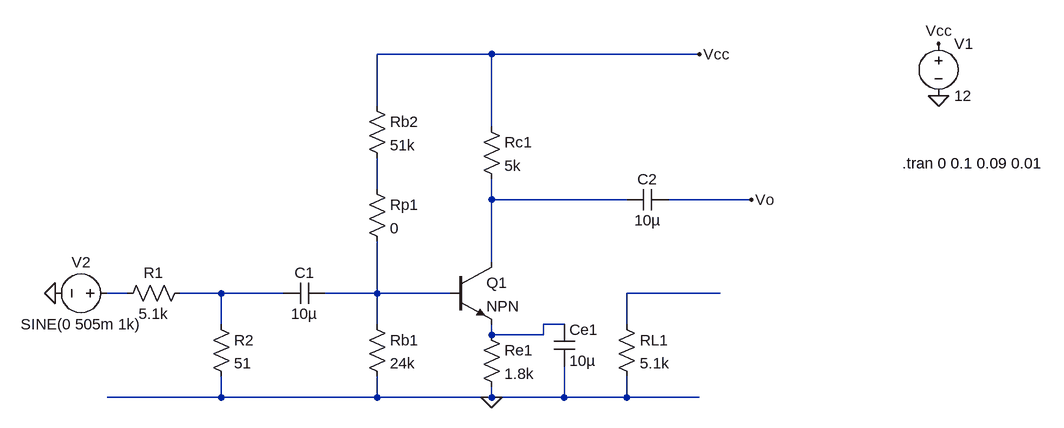
[diagram p0: schematic Experiment2_2_3.asc]
Experiment2_2_3.asc, the LTspice schematic file:
Version 4.1
SHEET 1 1096 680
WIRE 224 -32 48 -32
WIRE 544 -32 224 -32
WIRE 48 48 48 -32
WIRE 224 80 224 -32
WIRE 48 176 48 128
WIRE 224 192 224 160
WIRE 432 192 224 192
WIRE 624 192 496 192
WIRE 224 288 224 192
WIRE -336 336 -368 336
WIRE -192 336 -256 336
WIRE -96 336 -192 336
WIRE 48 336 48 256
WIRE 48 336 -32 336
WIRE 160 336 48 336
WIRE 576 336 432 336
WIRE -192 384 -192 336
WIRE 48 384 48 336
WIRE 336 384 304 384
WIRE 432 384 432 336
WIRE 224 400 224 384
WIRE 304 400 304 384
WIRE 304 400 224 400
WIRE -192 496 -192 464
WIRE -192 496 -368 496
WIRE 48 496 48 464
WIRE 48 496 -192 496
WIRE 224 496 224 480
WIRE 224 496 48 496
WIRE 336 496 336 448
WIRE 336 496 224 496
WIRE 432 496 432 464
WIRE 432 496 336 496
WIRE 544 496 432 496
FLAG 224 496 0
FLAG 544 -32 Vcc
FLAG 912 -48 Vcc
FLAG 912 32 0
FLAG 624 192 Vo
FLAG -448 336 0
SYMBOL res -240 320 R90
WINDOW 0 0 56 VBottom 2
WINDOW 3 32 56 VTop 2
SYMATTR InstName R1
SYMATTR Value 5.1k
SYMBOL res -208 368 R0
SYMATTR InstName R2
SYMATTR Value 51
SYMBOL res 32 368 R0
SYMATTR InstName Rb1
SYMATTR Value 24k
SYMBOL res 32 160 R0
SYMATTR InstName Rp1
SYMATTR Value 0
SYMBOL res 32 32 R0
SYMATTR InstName Rb2
SYMATTR Value 51k
SYMBOL npn 160 288 R0
SYMATTR InstName Q1
SYMBOL res 208 384 R0
SYMATTR InstName Re1
SYMATTR Value 1.8k
SYMBOL res 416 368 R0
SYMATTR InstName RL1
SYMATTR Value 5.1k
SYMBOL res 208 64 R0
SYMATTR InstName Rc1
SYMATTR Value 5k
SYMBOL voltage 912 -64 R0
WINDOW 123 0 0 Left 0
WINDOW 39 0 0 Left 0
SYMATTR InstName V1
SYMATTR Value 12
SYMBOL cap -32 320 R90
WINDOW 0 0 32 VBottom 2
WINDOW 3 32 32 VTop 2
SYMATTR InstName C1
SYMATTR Value 10µ
SYMATTR SpiceLine V=6.3 Irms=0 Rser=4 Lser=0 mfg="AVX" pn="TAJA106M006" type="Tantalum"
SYMBOL cap 432 208 R270
WINDOW 0 32 32 VTop 2
WINDOW 3 0 32 VBottom 2
SYMATTR InstName C2
SYMATTR Value 10µ
SYMATTR SpiceLine V=6.3 Irms=0 Rser=4 Lser=0 mfg="AVX" pn="TAJA106M006" type="Tantalum"
SYMBOL cap 320 384 R0
SYMATTR Value 10µ
SYMATTR InstName Ce1
SYMATTR SpiceLine V=6.3 Irms=0 Rser=4 Lser=0 mfg="AVX" pn="TAJA106M006" type="Tantalum"
SYMBOL voltage -352 336 R90
WINDOW 0 -32 56 VBottom 2
WINDOW 3 32 56 VTop 2
WINDOW 123 0 0 Left 0
WINDOW 39 0 0 Left 0
SYMATTR InstName V2
SYMATTR Value SINE(0 505m 1k)
TEXT 856 136 Left 2 !.tran 0 0.1 0.09 0.01

The netlist it stands for:
* Experiment2_2_3.asc
R1 N004 N003 5.1k
R2 N004 0 51
Rb1 N005 0 24k
Rp1 N001 N005 0
Rb2 Vcc N001 51k
Q1 N002 N005 N007 0 NPN
Re1 N007 0 1.8k
RL1 N006 0 5.1k
Rc1 Vcc N002 5k
V1 Vcc 0 12
C1 N005 N004 10µ V=6.3 Irms=0 Rser=4 Lser=0 mfg="AVX" pn="TAJA106M006" type="Tantalum"
C2 N002 Vo 10µ V=6.3 Irms=0 Rser=4 Lser=0 mfg="AVX" pn="TAJA106M006" type="Tantalum"
Ce1 N007 0 10µ V=6.3 Irms=0 Rser=4 Lser=0 mfg="AVX" pn="TAJA106M006" type="Tantalum"
V2 N003 0 SINE(0 505m 1k)
.model NPN NPN
.model PNP PNP
.lib standard.bjt
.tran 0 0.1 0.09 0.01
.backanno
.end